# EAGLE design dual.vca.jumper (EAGLE 9.6.2)
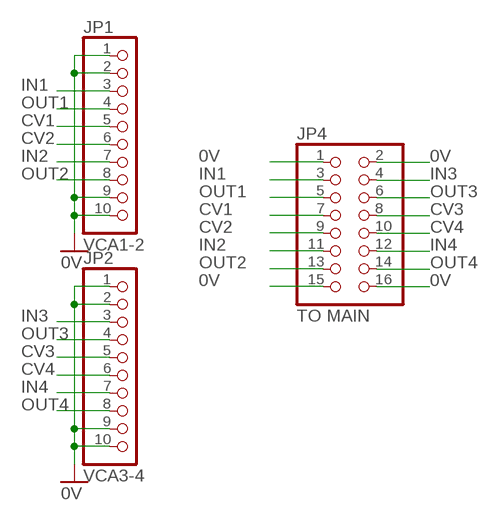
[diagram p0: schematic, sheet 1]

## Parts
JP1  VCA1-2  PINHD-1X10  [1X10]
JP2  VCA3-4  PINHD-1X10  [1X10]
JP4  TO MAIN  PINHD-2X8  [2X08]

## Nets
0V: JP1.1 JP1.2 JP1.9 JP1.10 JP2.1 JP2.2 JP2.9 JP2.10 JP4.1 JP4.2 JP4.15 JP4.16
CV1: JP1.5 JP4.7
CV2: JP1.6 JP4.9
CV3: JP2.5 JP4.8
CV4: JP2.6 JP4.10
IN1: JP1.3 JP4.3
IN2: JP1.7 JP4.11
IN3: JP2.3 JP4.4
IN4: JP2.7 JP4.12
OUT1: JP1.4 JP4.5
OUT2: JP1.8 JP4.13
OUT3: JP2.4 JP4.6
OUT4: JP2.8 JP4.14

## Library data of the parts
JP1 JP2 = pinhead:PINHD-1X10: PIN HEADER
JP4 = pinhead:PINHD-2X8: PIN HEADER

## Net classes
0 default: width 0.813 mm, clearance 0.406 mm

## Board
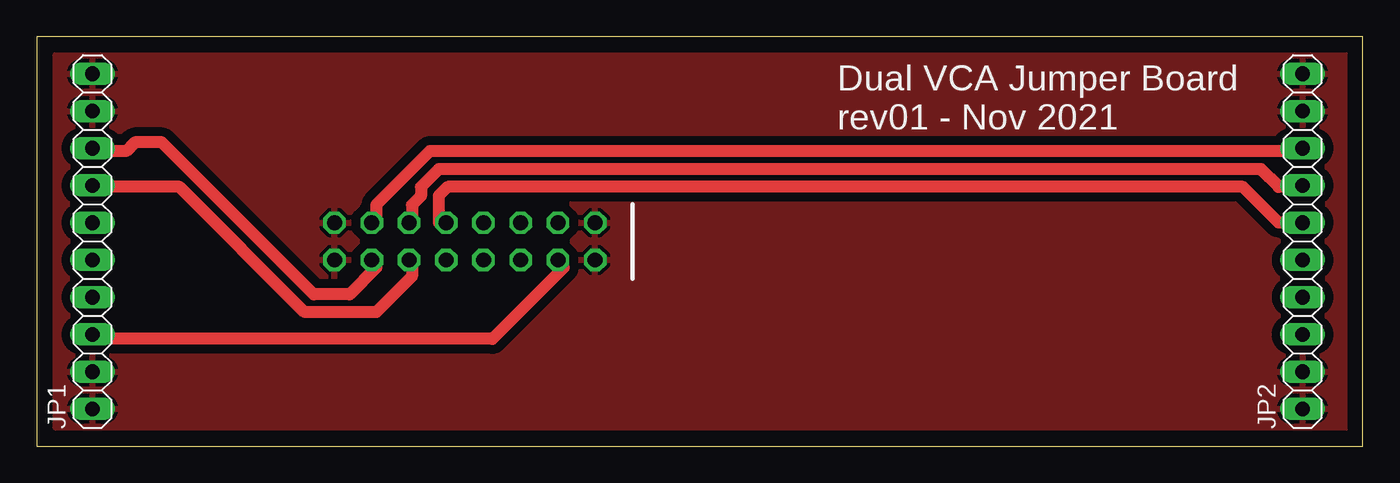
[diagram p1: board, top side]
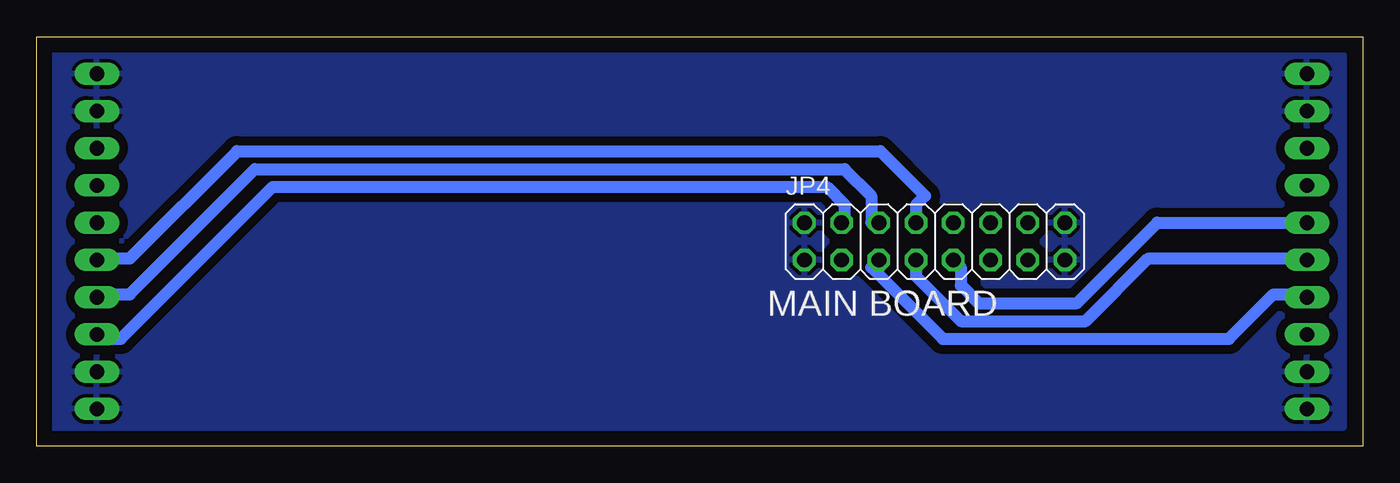
[diagram p2: board, bottom side, seen from below]

Size 90.47 x 27.93 mm. Coordinates in mm from the lower left corner, seen from the top.
Outline: 0,0 90.47,0 90.47,27.93 0,27.93 0,0
Copper layers (1*16): Top 0.035mm / dielectric 1.5mm / Bottom 0.035mm
Design rules "default": minimum track width 6mil, minimum drill 0.35mm, track to track 6mil, track to pad 6mil, pad to pad 6mil, via to via 6mil, smd to smd 6mil, copper to edge 40mil, drill to drill 6mil, minimum pad ring 10mil, minimum via ring 8mil, stop-mask expansion 4mil, vias tented up to drill 0mil, thermal gap 10mil

### Footprints (pad centres in the part's own frame; a part is rotated, then mirrored left to right if it is on the bottom)
1X10 = drill 1.016 long: 1 -11.43,0; 2 -8.89,0; 3 -6.35,0; 4 -3.81,0; 5 -1.27,0; 6 1.27,0; 7 3.81,0; 8 6.35,0; 9 8.89,0; 10 11.43,0
2X08 = drill 1.016 octagon: 1 -8.89,-1.27; 2 -8.89,1.27; 3 -6.35,-1.27; 4 -6.35,1.27; 5 -3.81,-1.27; 6 -3.81,1.27; 7 -1.27,-1.27; 8 -1.27,1.27; 9 1.27,-1.27; 10 1.27,1.27; 11 3.81,-1.27; 12 3.81,1.27; 13 6.35,-1.27; 14 6.35,1.27; 15 8.89,-1.27; 16 8.89,1.27

### Placement (x,y rotation side)
JP1  3.81,13.97 90 top
JP2  86.36,13.97 90 top
JP4  29.21,13.97 0 bottom

### Tracks (layer width: path | path; a pad name or v marks a point on that pad's centre or on a via)
0V
  pour Top (isolate 0.61): 1.27,26.67 89.41,26.67 89.41,1.27 1.27,1.27
  pour Bottom (isolate 0.61): 1.27,26.67 89.53,26.67 89.53,1.27 1.27,1.27
CV1
  Bottom 0.813: JP4.7 30.48,11.58 27.43,8.53 18.9,8.53 14.63,12.8 4.27,12.8 JP1.5
CV2
  Bottom 0.813: JP1.6 14.02,15.24 19.51,9.75 26.21,9.75 27.43,10.97 27.43,12.19 JP4.9
CV3
  Bottom 0.813: JP4.8 30.48,16.46 29.87,17.07 32.92,20.12 76.81,20.12 84.12,12.8 85.95,12.8 JP2.5
CV4
  Top 0.813: JP2.6 84.73,15.24 82.3,17.68 28.04,17.68 27.43,17.07 27.43,15.24 JP4.10
IN1
  Top 0.813: JP1.3 4.27,7.32 31.09,7.32 35.97,12.19 JP4.3
IN2
  Top 0.813: JP1.7 4.27,17.68 9.75,17.68 18.29,9.14 23.16,9.14 25.6,11.58 25.6,12.19 JP4.11
IN3
  Bottom 0.813: JP4.4 35.36,15.24 35.36,16.46 36.58,17.68 74.37,17.68 84.73,7.32 85.95,7.32 JP2.3
IN4
  Top 0.813: JP4.12 25.6,15.24 25.6,16.46 26.21,17.07 26.21,17.68 27.43,18.9 83.52,18.9 84.73,17.68 85.95,17.68 JP2.7
OUT1
  Bottom 0.813: JP1.4 4.27,10.36 6.1,10.36 9.14,7.32 28.65,7.32 33.53,12.19 JP4.5
OUT2
  Top 0.813: JP1.8 4.27,20.12 6.1,20.12 6.71,20.73 8.53,20.73 18.9,10.36 21.34,10.36 23.16,12.19 JP4.13
OUT3
  Bottom 0.813: JP4.6 33.53,15.24 33.53,17.07 35.36,18.9 75.59,18.9 84.12,10.36 85.95,10.36 JP2.4
OUT4
  Top 0.813: JP4.14 23.16,15.24 23.16,16.46 26.82,20.12 85.95,20.12 JP2.8

### Text on the board
tNames: Dual VCA Jumper Board / rev01 - Nov 2021
bNames: MAIN BOARD